# EasyEDA Pro project AC2024-欧标单相v1.2（使用立创EDA专业版）.epro, schematic _AC2024-02

## Sheets
1 01_AC
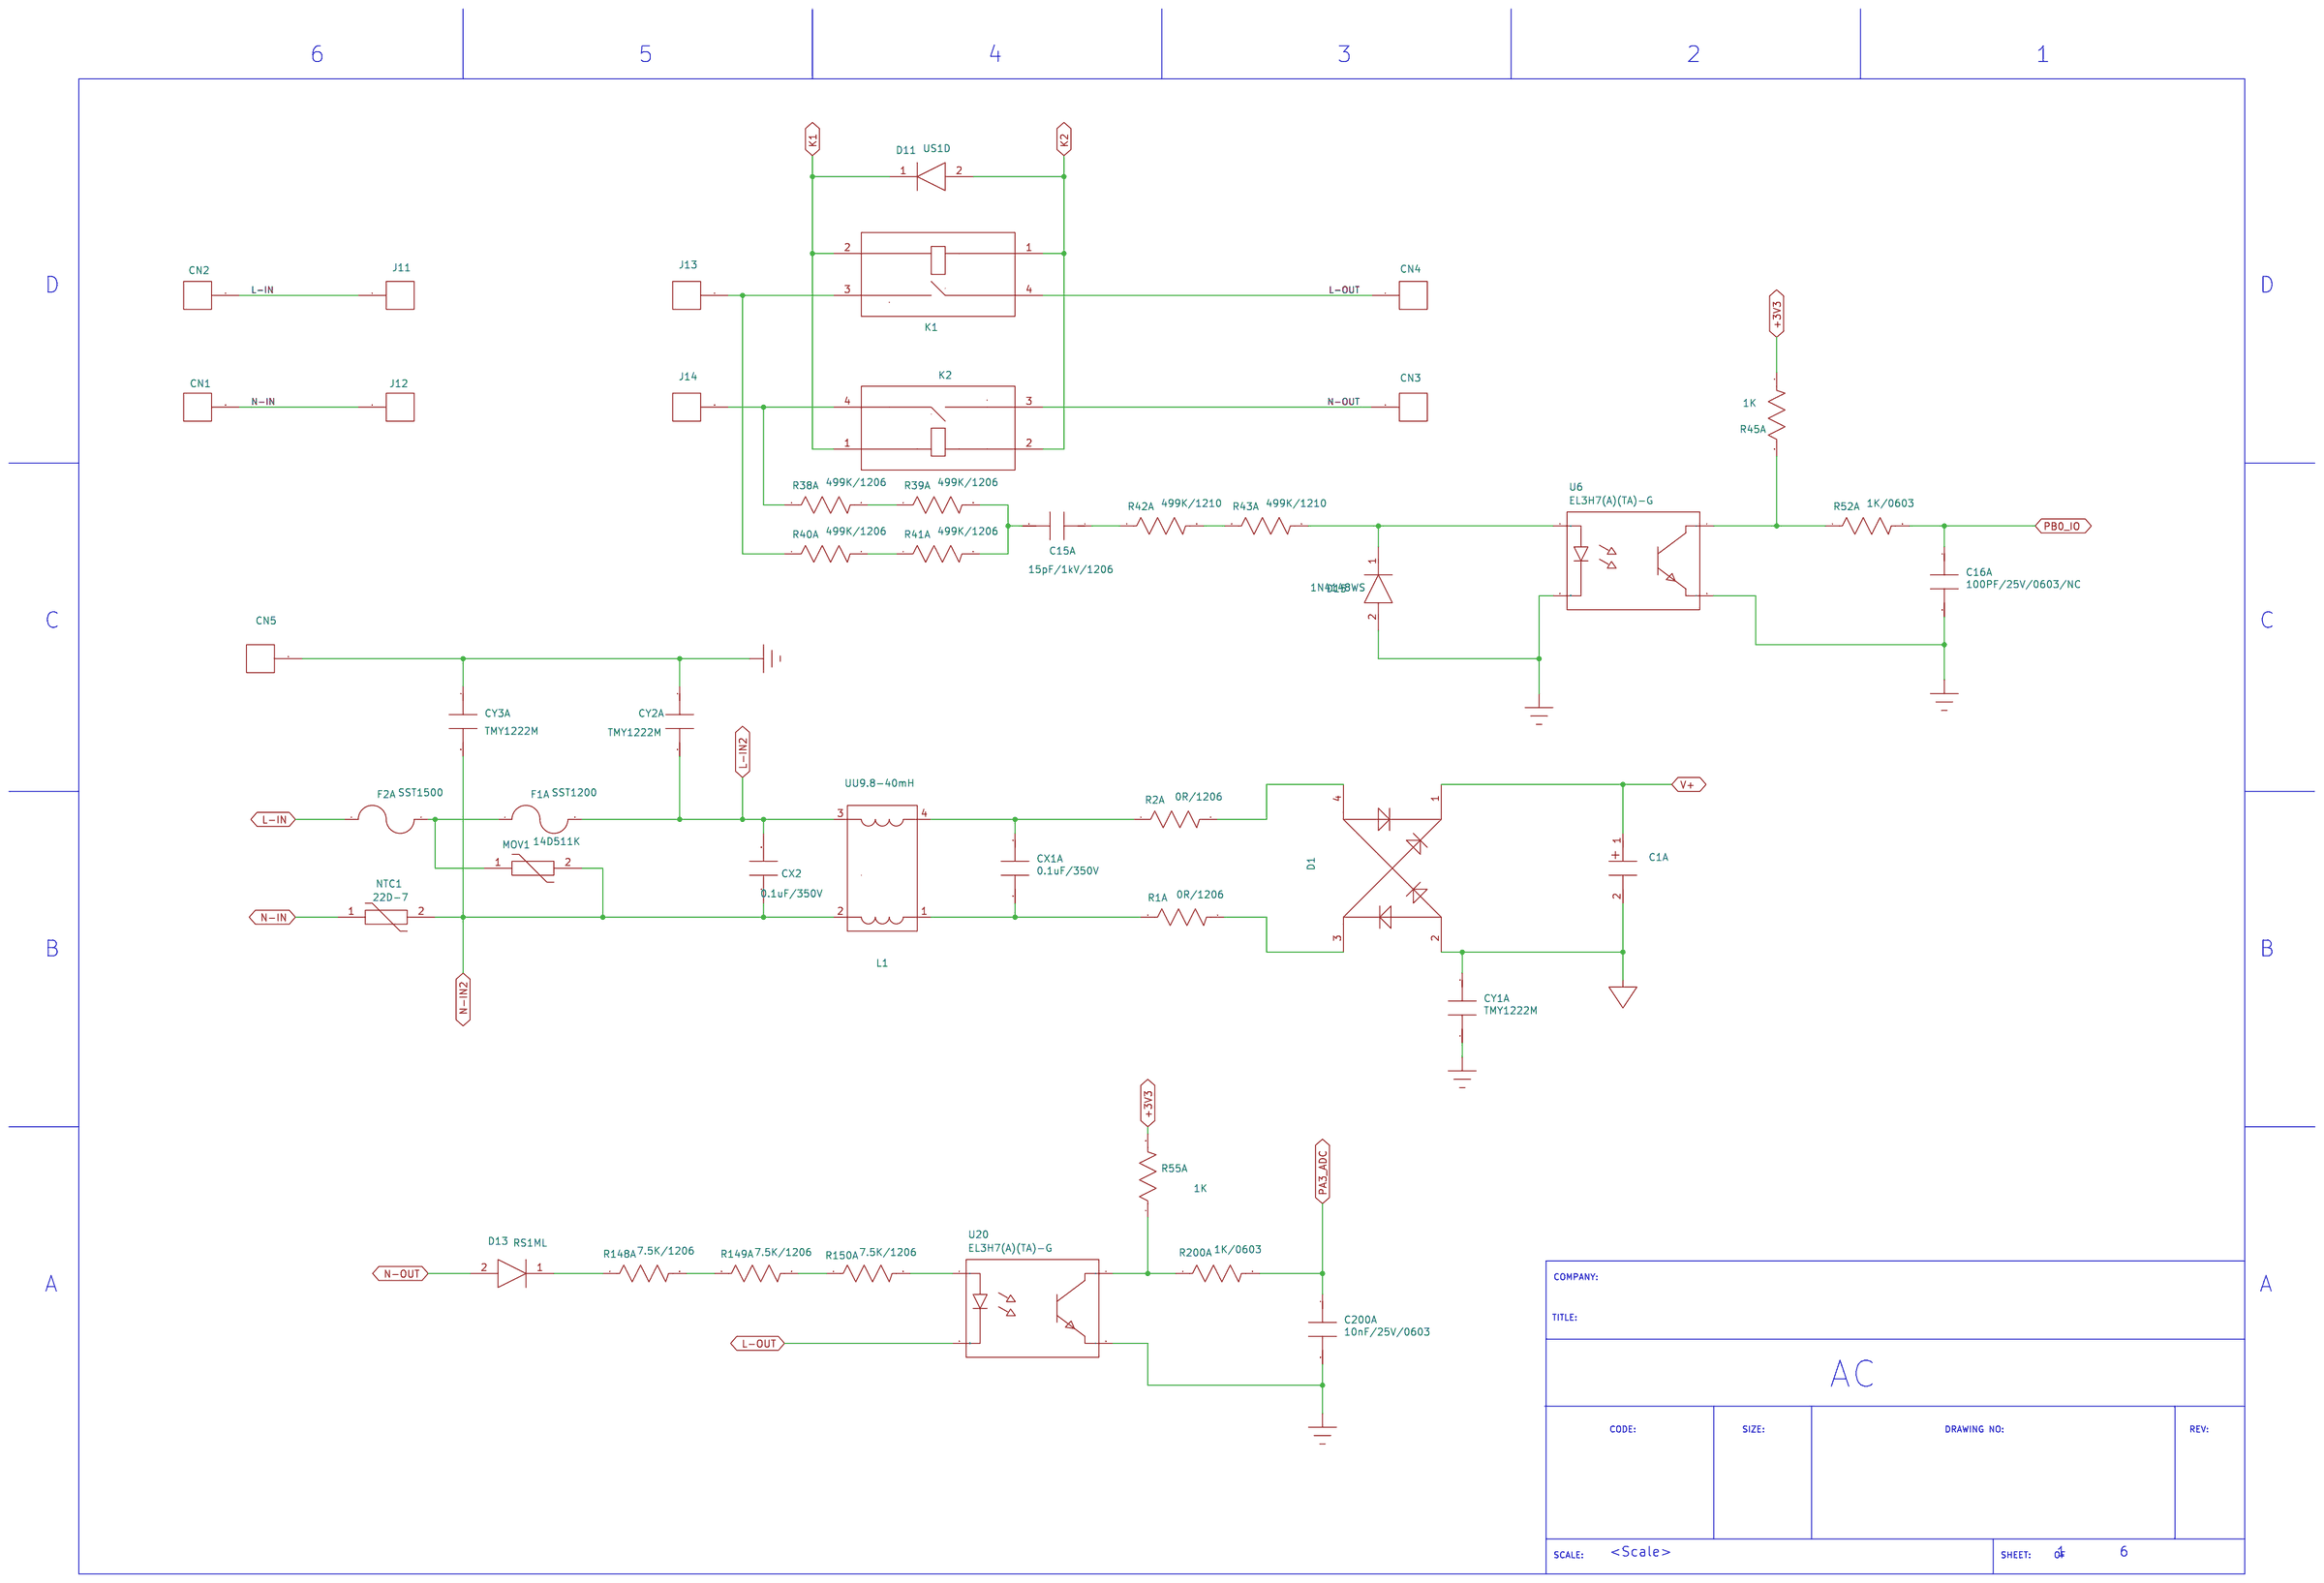
[diagram p0: 01_AC]
2 02_DC: Board Name: _AC2024-02; Create Date: 2025-07-22; Page Name: 02_DC; Project Name: AC2024-02欧标单相; Schematic Name: _AC2024-02; Update Date: 2025-11-24; Number of Sheets: 6; Scale: <Scale>; Sheet Number: 2
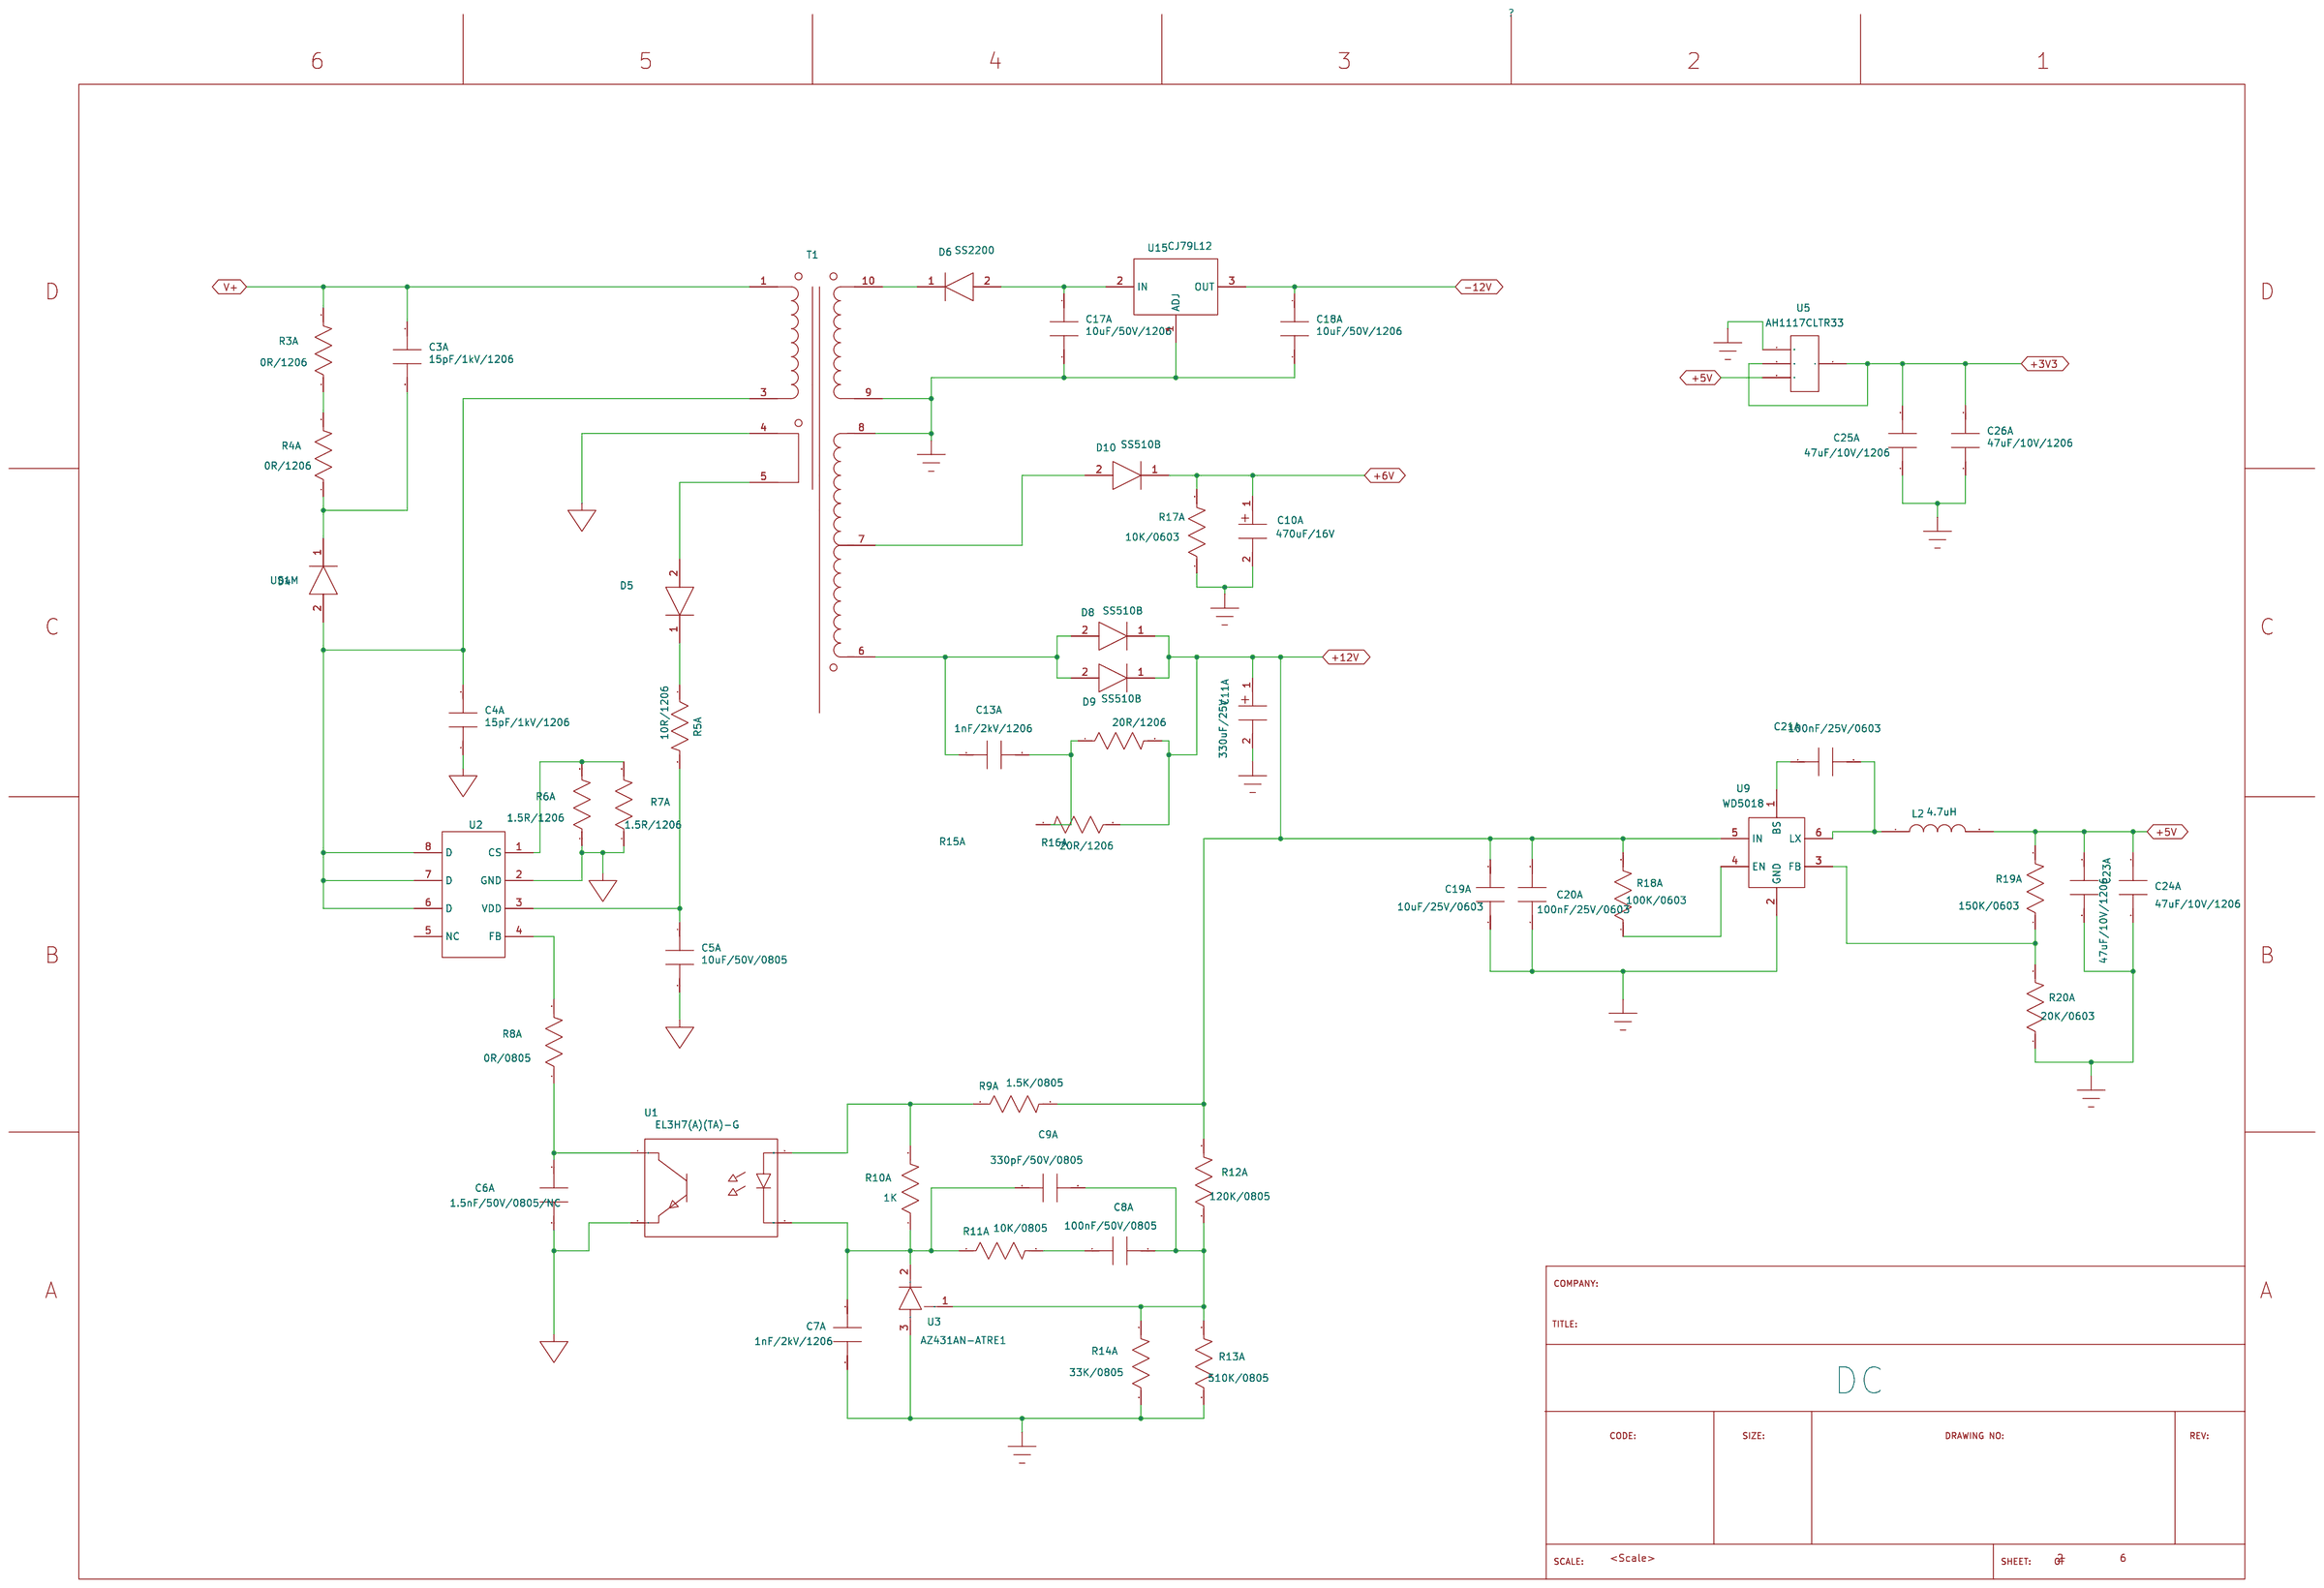
[diagram p1: 02_DC]
3 03_KZ: Board Name: _AC2024-02; Create Date: 2025-07-22; Page Name: 03_KZ; Project Name: AC2024-02欧标单相; Schematic Name: _AC2024-02; Update Date: 2025-07-22; Number of Sheets: 6; Scale: <Scale>; Sheet Number: 3
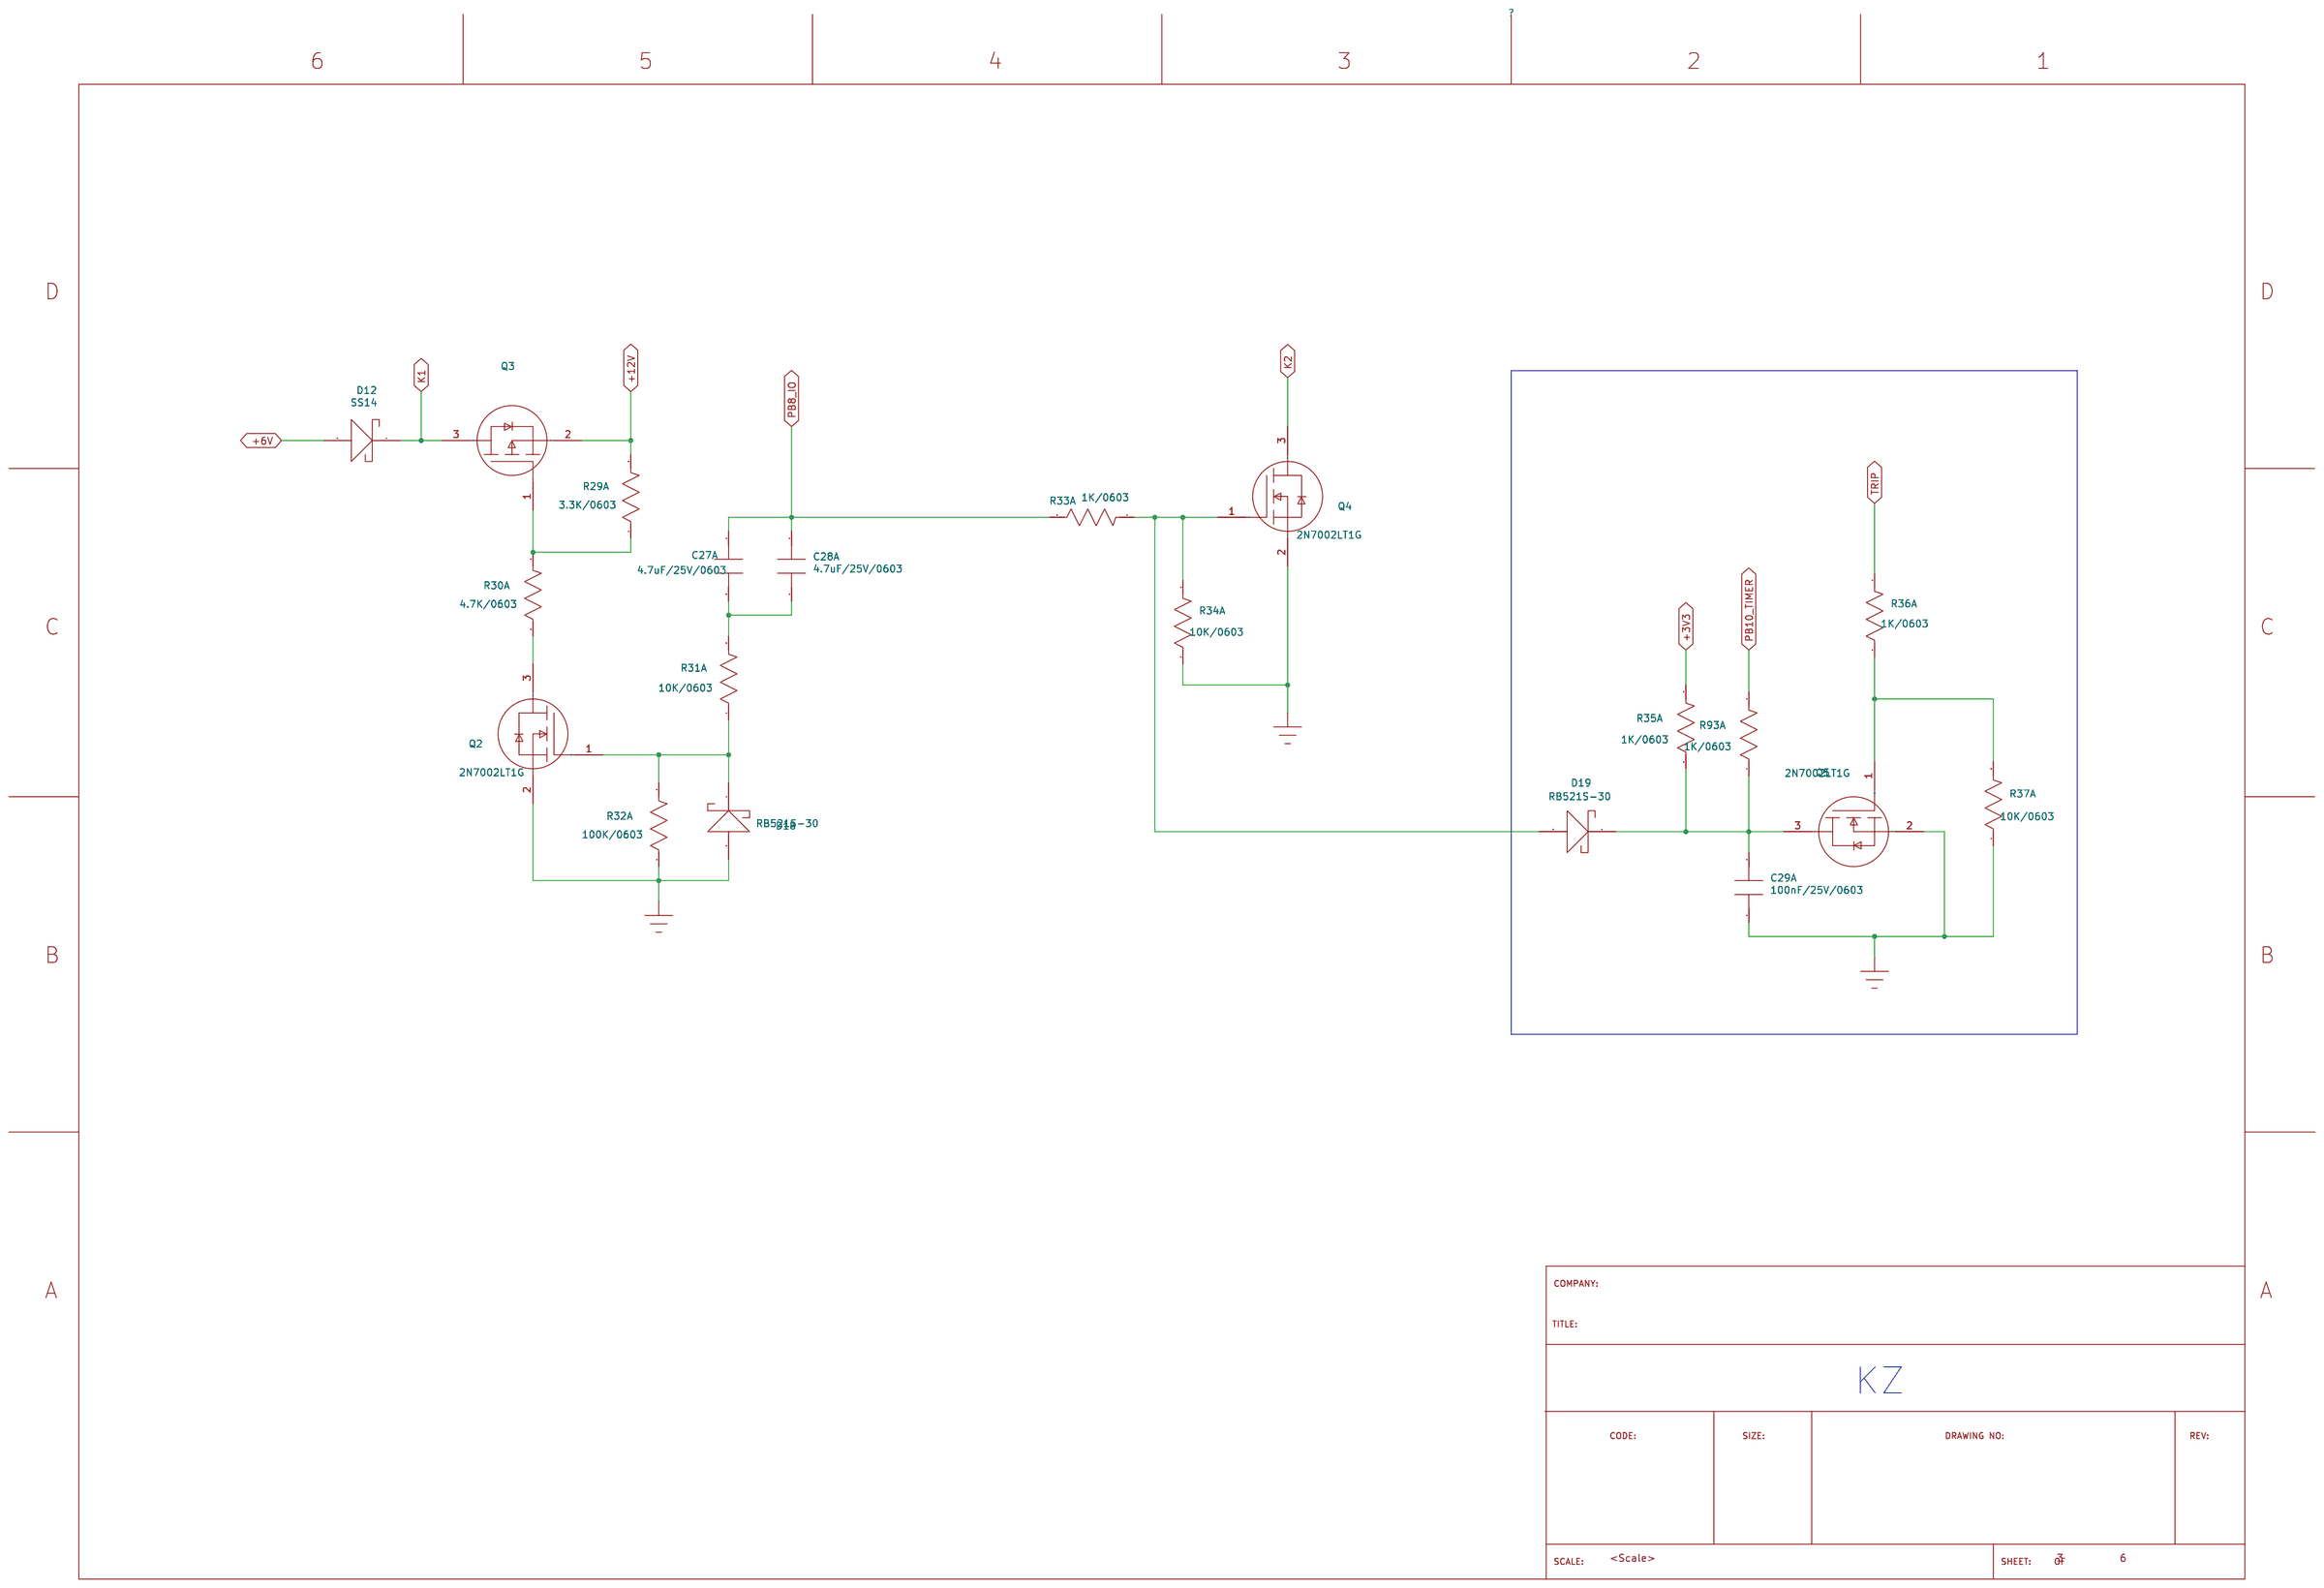
[diagram p2: 03_KZ]
4 04_CP
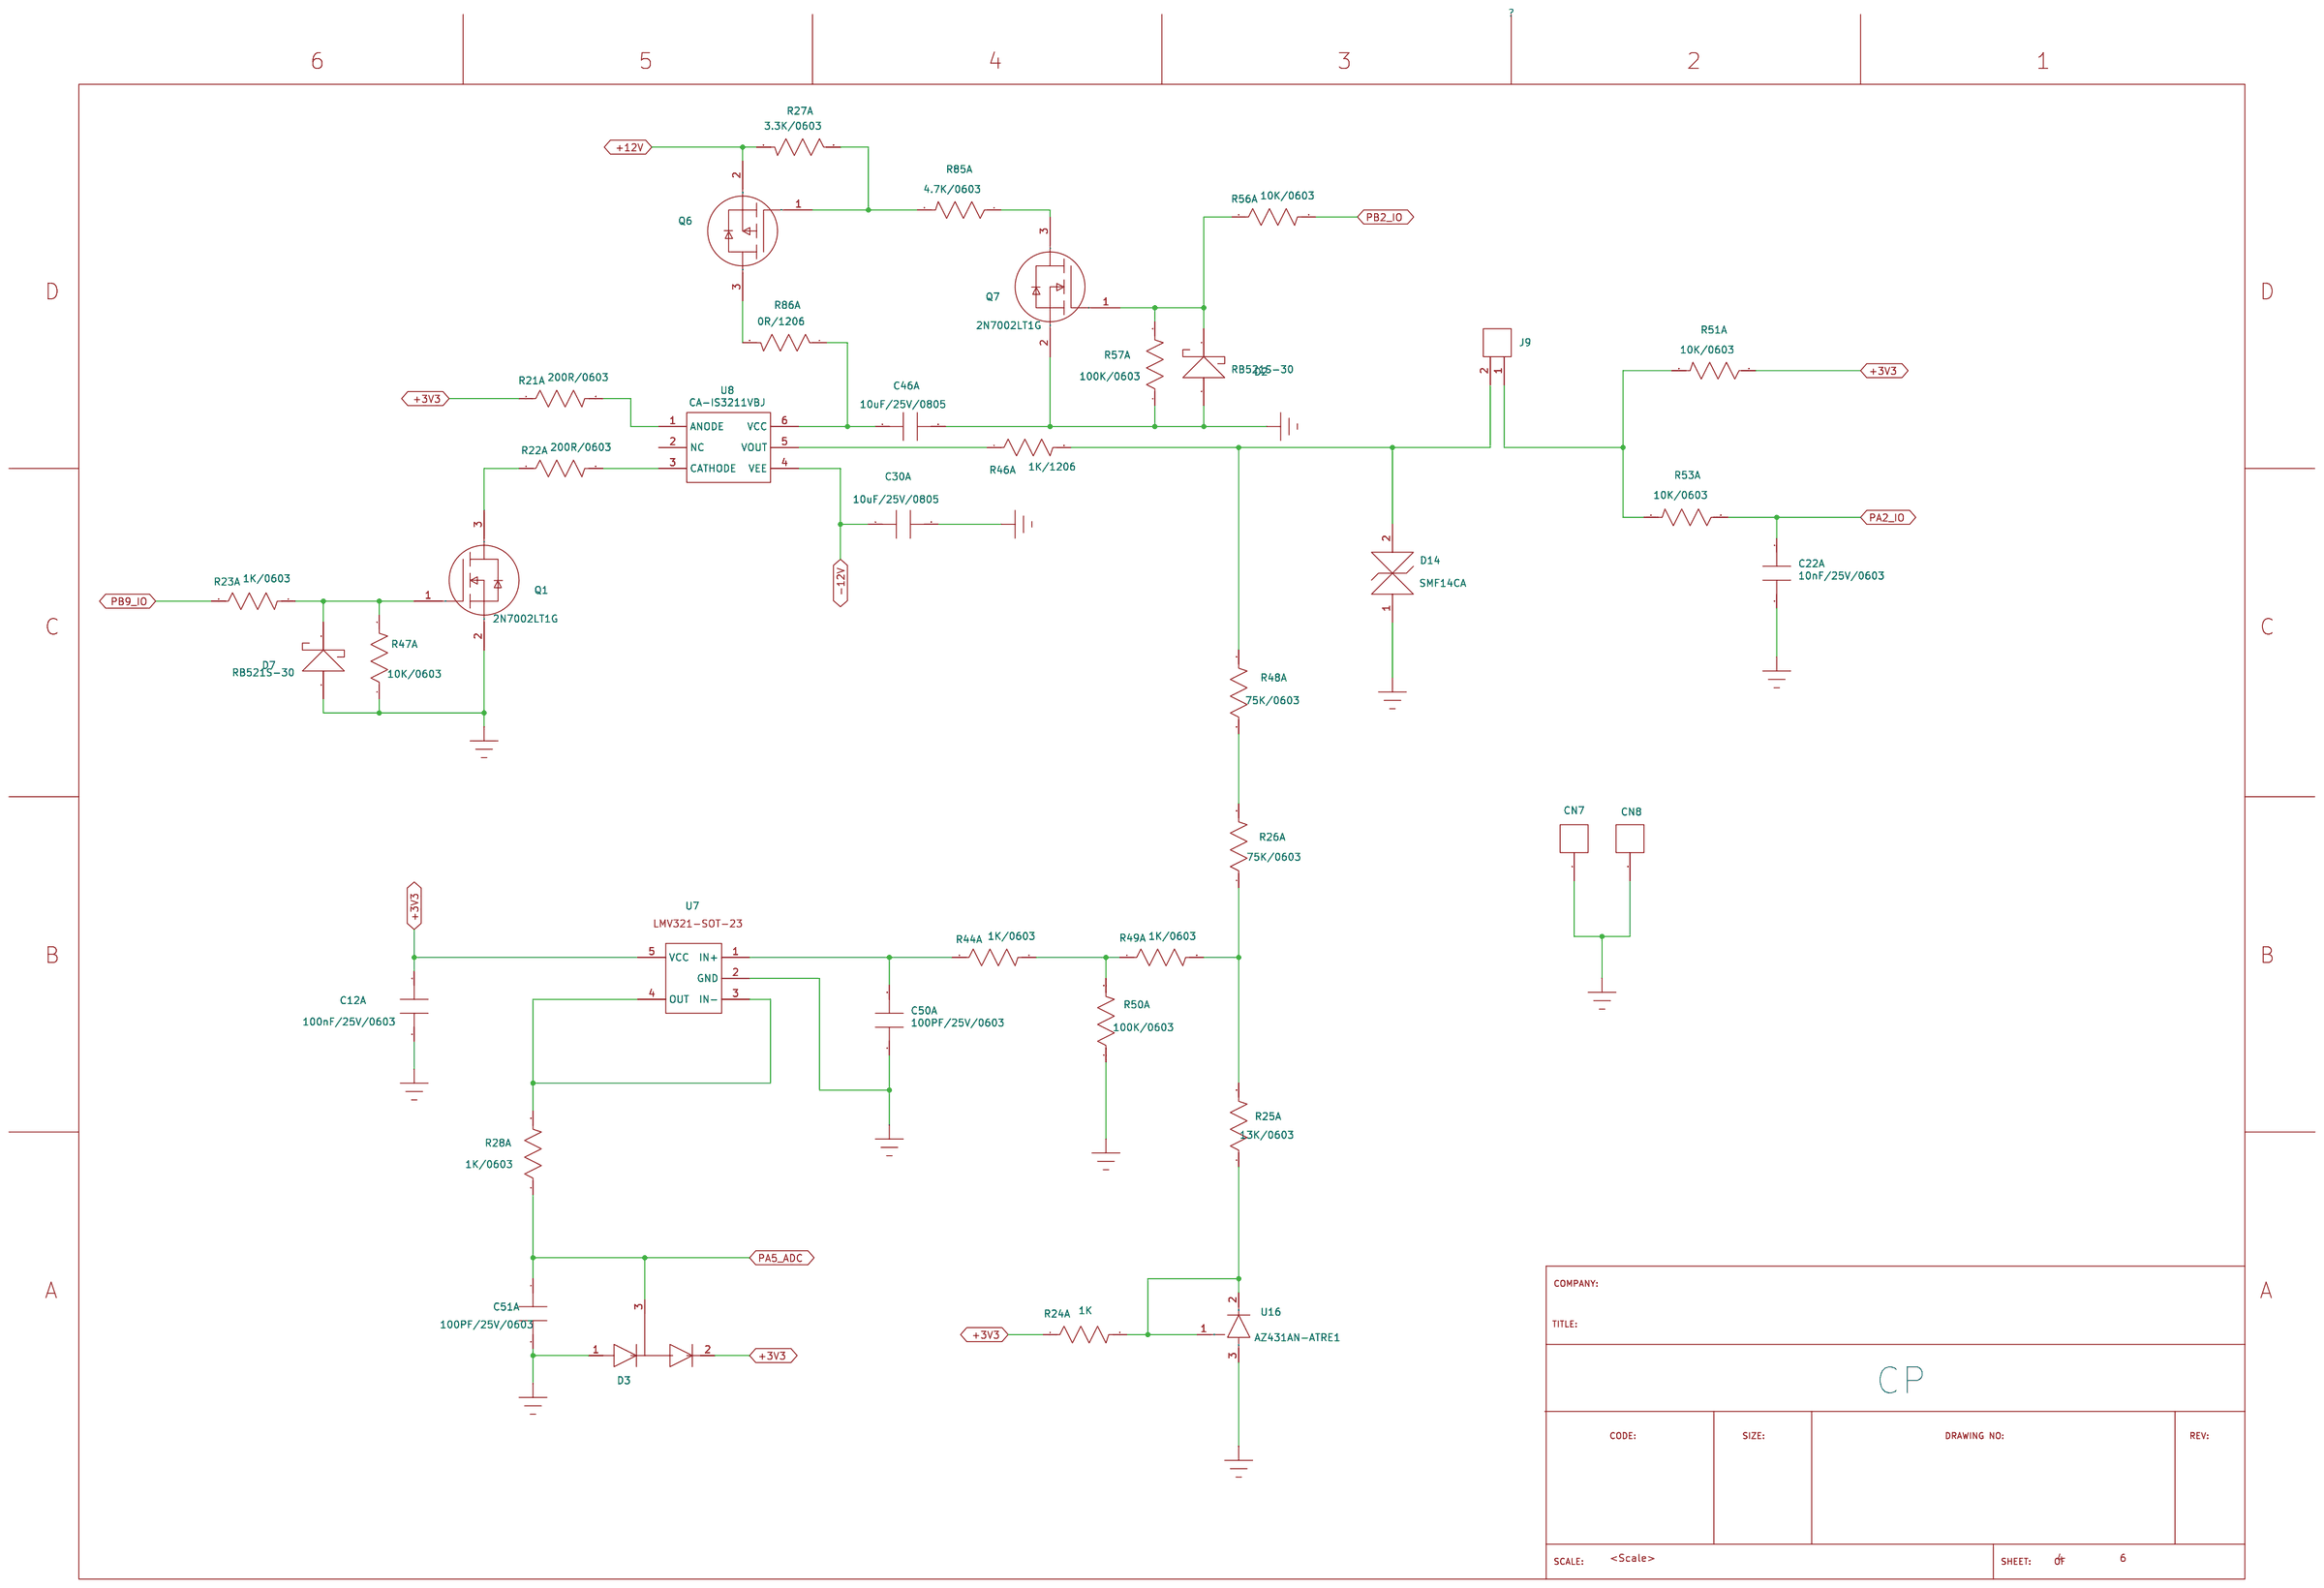
[diagram p3: 04_CP]
5 05_CY: Board Name: _AC2024-02; Create Date: 2025-07-22; Page Name: 05_CY; Project Name: AC2024-02欧标单相; Schematic Name: _AC2024-02; Update Date: 2025-07-22; Number of Sheets: 6; Scale: <Scale>; Sheet Number: 5
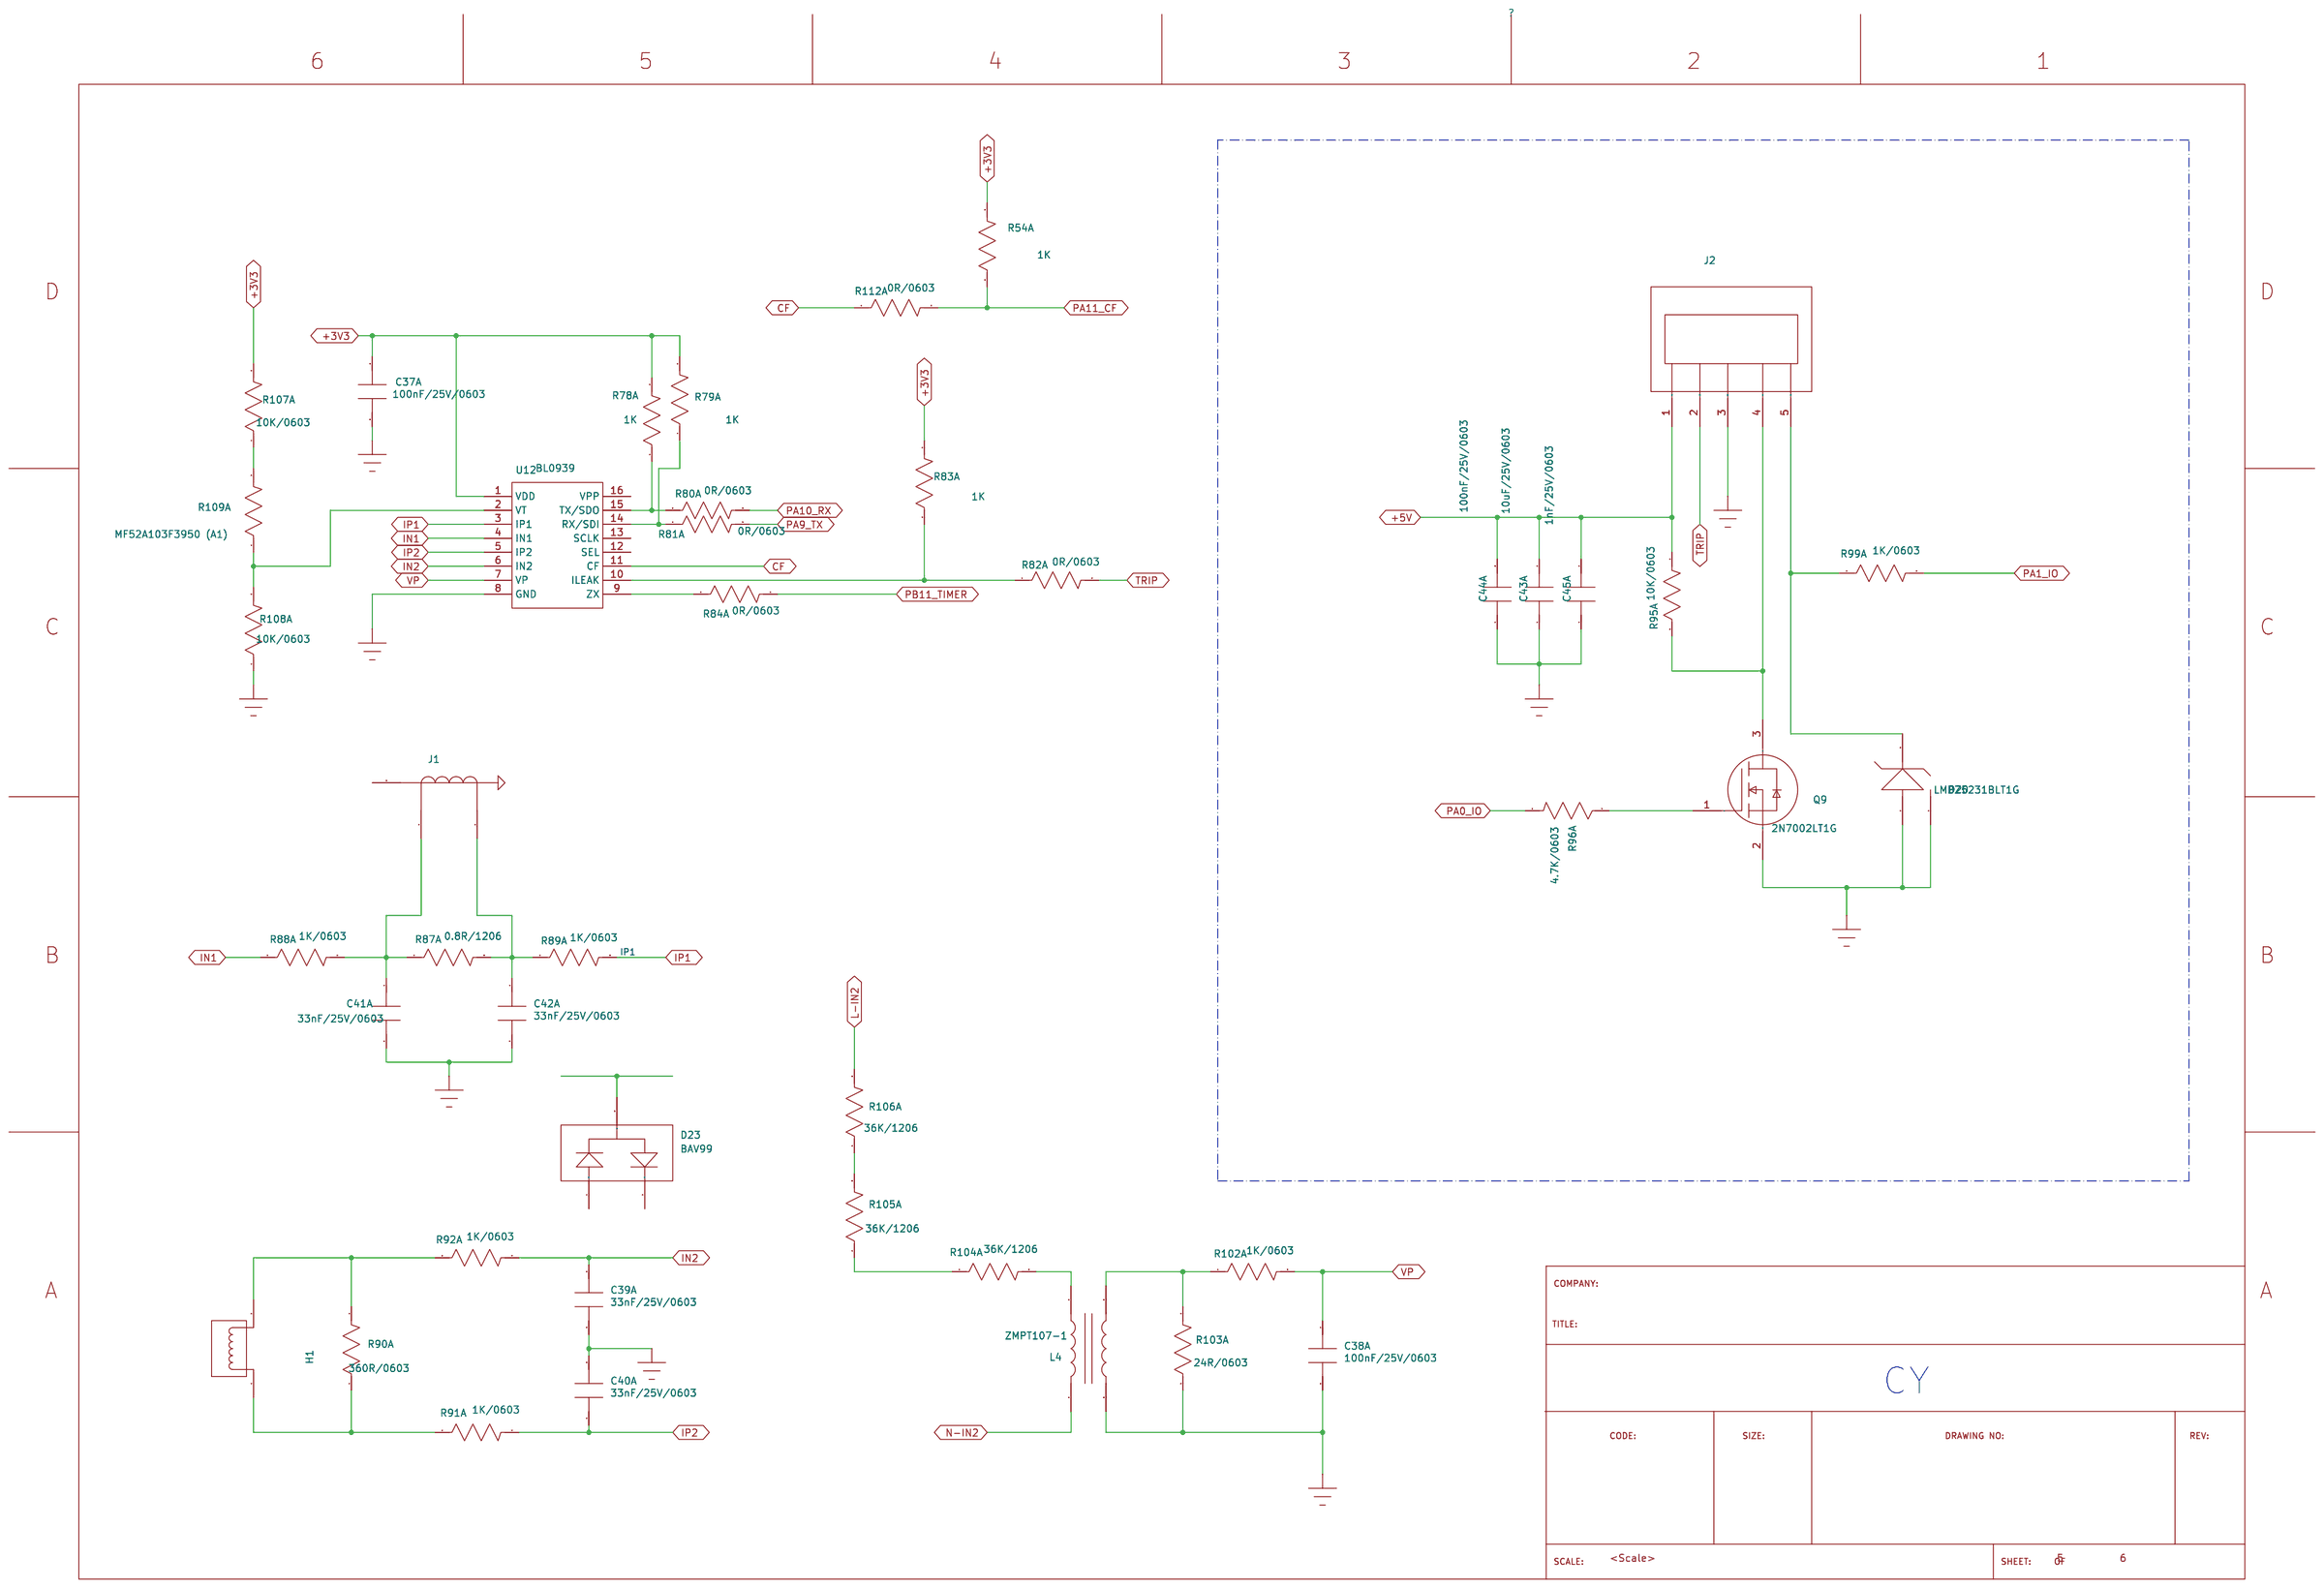
[diagram p4: 05_CY]
6 06_MCU
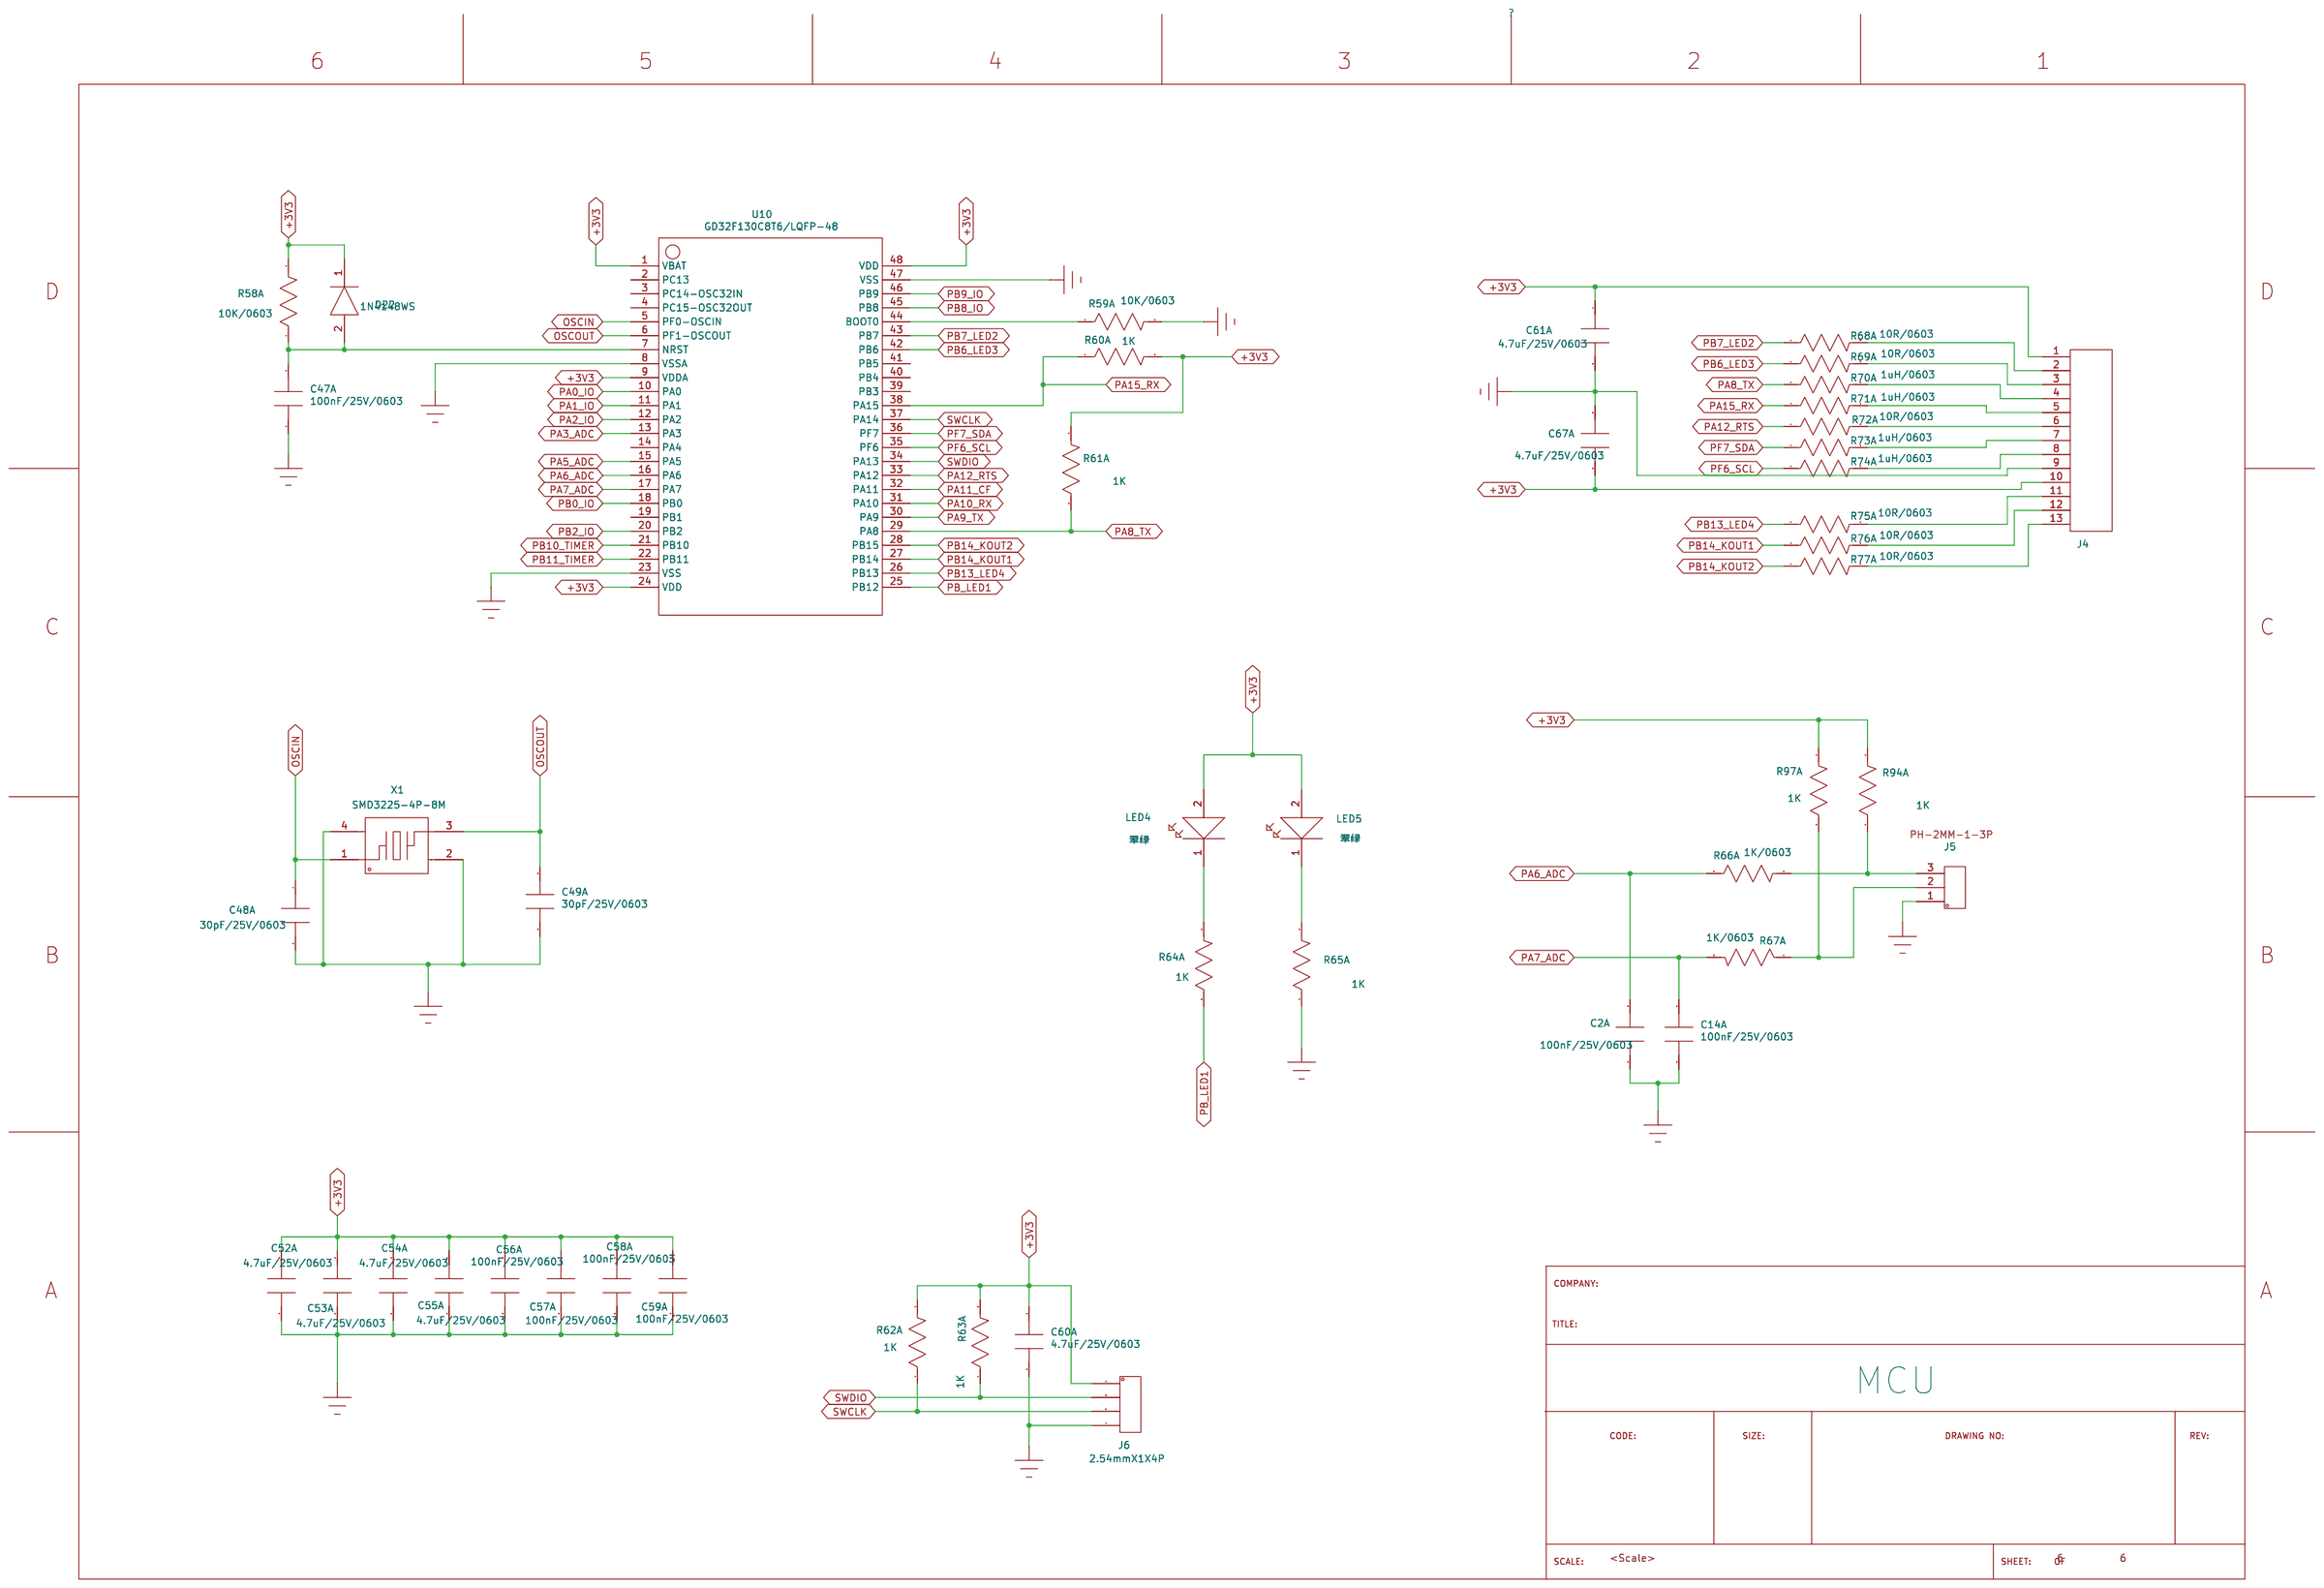
[diagram p5: 06_MCU]
7 P7: Create Date: 2025-10-23; Company: 嘉立创EDA; Page Size: A4; Version: V1.0
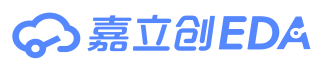
[diagram p6: P7]

## Parts
sheet 01_AC
C1  CAP-AE4  [C-P-5MM]  (section A_CAP+)
C15  15pF/1kV/1206  [C1206]  (section A_CAP)
C16  100PF/25V/0603/NC  [C0603]  (section A_CAP)
C200  10nF/25V/0603  [C0603]  (section A_CAP)
CN1  YZ-9/5mmX9.9mm  [YZ-9]
CN2  YZ-9/5mmX9.9mm  [YZ-9]
CN3  YZ-9/5mmX9.9mm  [YZ-9]
CN4  YZ-9/5mmX9.9mm  [YZ-9]
CN5  ZY-65/5X8  [YZ-63/5X8]
CX1  0.1uF/350V  [DIP-X2-7.5MM]  (section A_CAP)
CX2  0.1uF/350V  [DIP-X2-7.5MM]
CY1  TMY1222M  [SMD-Y1-5.4X7.8MM]  (section A_CAP)
CY2  TMY1222M  [SMD-Y1-5.4X7.8MM]  (section A_CAP)
CY3  TMY1222M  [SMD-Y1-5.4X7.8MM]  (section A_CAP)
D1  MB10S  [MB10S-MBS]
D11  US1D  [SMA-DO-214AC]
D13  RS1ML  [SOD-123FL-SMF14A]
D15  1N4148WS  [SOD-323]
F1  SST1200  [SMD-F-6.1X2.7MM]  (section A_FUSE-H)
F2  SST1500  [SMD-F-6.1X2.7MM]  (section A_FUSE-H)
J11  F10-10-6.5-0.4 Z  [3.1-3.8/5/6]
J12  F10-10-6.5-0.4 Z  [3.1-3.8/5/6]
J13  F10-10-6.5-0.4 Z  [3.2/4-6]
J14  F10-10-6.5-0.4 Z  [3.2/4-6]
K1  HF161  [HF161F-W/12-HT/2]
K2  HF161  [HF161F-W/12-HT/2]
L1  UU9.8-40mH  [UU9.8-40MH]
MOV1  14D511K  [DIP-RV-7.5MM]
NTC1  22D-7  [NTC-22D-7-P=5MM]
R1  0R/1206  [R1206]  (section A_RESZ-H)
R2  0R/1206  [R1206]  (section A_RESZ-H)
R38  499K/1206  [R1206]  (section A_RESZ-H)
R39  499K/1206  [R1206]  (section A_RESZ-H)
R40  499K/1206  [R1206]  (section A_RESZ-H)
R41  499K/1206  [R1206]  (section A_RESZ-H)
R42  499K/1210  [R1210]  (section A_RESZ-H)
R43  499K/1210  [R1210]  (section A_RESZ-H)
R45  1K  [R0603]  (section A_RESZ-H)
R52  1K/0603  [R0603]  (section A_RESZ-H)
R55  1K  [R0603]  (section A_RESZ-H)
R148  7.5K/1206  [R1206]  (section A_RESZ-H)
R149  7.5K/1206  [R1206]  (section A_RESZ-H)
R150  7.5K/1206  [R1206]  (section A_RESZ-H)
R200  1K/0603  [R0603]  (section A_RESZ-H)
U6  EL3H7(A)(TA)-G  [SSOP-4]
U20  EL3H7(A)(TA)-G  [SSOP-4]
sheet 02_DC
C3  15pF/1kV/1206  [C1206]  (section A_CAP)
C4  15pF/1kV/1206  [C1206]  (section A_CAP)
C5  10uF/50V/0805  [C0805]  (section A_CAP)
C6  1.5nF/50V/0805/NC  [C0805]  (section A_CAP)
C7  1nF/2kV/1206  [C1206]  (section A_CAP)
C8  100nF/50V/0805  [C0805]  (section A_CAP)
C9  330pF/50V/0805  [C0805]  (section A_CAP)
C10  470uF/16V  [SMD-C-D8XL10.5MM]  (section A_CAP+)
C11  330uF/25V  [SMD-C-D8XL10.5MM]  (section A_CAP+)
C13  1nF/2kV/1206  [C1206]  (section A_CAP)
C17  10uF/50V/1206  [C1206]  (section A_CAP)
C18  10uF/50V/1206  [C1206]  (section A_CAP)
C19  10uF/25V/0603  [C0603]  (section A_CAP)
C20  100nF/25V/0603  [C0603]  (section A_CAP)
C21  100nF/25V/0603  [C0603]  (section A_CAP)
C23  47uF/10V/1206  [C1206]  (section A_CAP)
C24  47uF/10V/1206  [C1206]  (section A_CAP)
C25  47uF/10V/1206  [C1206]  (section A_CAP)
C26  47uF/10V/1206  [C1206]  (section A_CAP)
D4  US1M  [SMA-DO-214AC]
D5  D  [SMAF]
D6  SS2200  [SMA-DO-214AC]
D8  SS510B  [SMB-DO-214AA]
D9  SS510B  [SMB-DO-214AA]
D10  SS510B  [SMB-DO-214AA]
L2  4.7uH  [SMD/L/5X5MM]
R3  0R/1206  [R1206]  (section A_RESZ-H)
R4  0R/1206  [R1206]  (section A_RESZ-H)
R5  10R/1206  [R1206]  (section A_RESZ-H)
R6  1.5R/1206  [R1206]  (section A_RESZ-H)
R7  1.5R/1206  [R1206]  (section A_RESZ-H)
R8  0R/0805  [R0805]  (section A_RESZ-H)
R9  1.5K/0805  [R0805]  (section A_RESZ-H)
R10  1K  [R0805]  (section A_RESZ-H)
R11  10K/0805  [R0805]  (section A_RESZ-H)
R12  120K/0805  [R0805]  (section A_RESZ-H)
R13  510K/0805  [R0805]  (section A_RESZ-H)
R14  33K/0805  [R0805]  (section A_RESZ-H)
R15  20R/1206  [R1206]  (section A_RESZ-H)
R16  20R/1206  [R1206]  (section A_RESZ-H)
R17  10K/0603  [R0603]  (section A_RESZ-H)
R18  100K/0603  [R0603]  (section A_RESZ-H)
R19  150K/0603  [R0603]  (section A_RESZ-H)
R20  20K/0603  [R0603]  (section A_RESZ-H)
T1  T-10  [EE16-4-5]
U1  EL3H7(A)(TA)-G  [SSOP-4]
U2  OB5102P  [DIP8-2]
U3  AZ431AN-ATRE1  [SOT-23]
U5  AH1117CLTR33  [SOT-223-3]
U9  WD5018  [SOT23-6]
U15  CJ79L12  [SOT-89]
sheet 03_KZ
C27  4.7uF/25V/0603  [C0603]  (section A_CAP)
C28  4.7uF/25V/0603  [C0603]  (section A_CAP)
C29  100nF/25V/0603  [C0603]  (section A_CAP)
D12  SS14  [SMA-DO-214AC]
D18  RB521S-30  [SOD-523]
D19  RB521S-30  [SOD-523]
Q2  2N7002LT1G  [SOT-23]
Q3  AO3407(P)  [SOT-23]
Q4  2N7002LT1G  [SOT-23]
Q5  2N7002LT1G  [SOT-23]
R29  3.3K/0603  [R0603]  (section A_RESZ-H)
R30  4.7K/0603  [R0603]  (section A_RESZ-H)
R31  10K/0603  [R0603]  (section A_RESZ-H)
R32  100K/0603  [R0603]  (section A_RESZ-H)
R33  1K/0603  [R0603]  (section A_RESZ-H)
R34  10K/0603  [R0603]  (section A_RESZ-H)
R35  1K/0603  [R0603]  (section A_RESZ-H)
R36  1K/0603  [R0603]  (section A_RESZ-H)
R37  10K/0603  [R0603]  (section A_RESZ-H)
R93  1K/0603  [R0603]  (section A_RESZ-H)
sheet 04_CP
C12  100nF/25V/0603  [C0603]  (section A_CAP)
C22  10nF/25V/0603  [C0603]  (section A_CAP)
C30  10uF/25V/0805  [C0805]  (section A_CAP)
C46  10uF/25V/0805  [C0805]  (section A_CAP)
C50  100PF/25V/0603  [C0603]  (section A_CAP)
C51  100PF/25V/0603  [C0603]  (section A_CAP)
CN7  CN  [4/5.5]
CN8  CN  [4/5.5]
D2  RB521S-30  [SOD-523]
D3  BAT54S  [SOT-23]
D7  RB521S-30  [SOD-523]
D14  SMF14CA  [SOD-123FL-SMF14A]
J9  KF142V  [KF142R]
Q1  2N7002LT1G  [SOT-23]
Q6  AO3407(P)  [SOT-23]
Q7  2N7002LT1G  [SOT-23]
R21  200R/0603  [R0603]  (section A_RESZ-H)
R22  200R/0603  [R0603]  (section A_RESZ-H)
R23  1K/0603  [R0603]  (section A_RESZ-H)
R24  1K  [R0603]  (section A_RESZ-H)
R25  13K/0603  [R0603]  (section A_RESZ-H)
R26  75K/0603  [R0603]  (section A_RESZ-H)
R27  3.3K/0603  [R0603]  (section A_RESZ-H)
R28  1K/0603  [R0603]  (section A_RESZ-H)
R44  1K/0603  [R0603]  (section A_RESZ-H)
R46  1K/1206  [R1206]  (section A_RESZ-H)
R47  10K/0603  [R0603]  (section A_RESZ-H)
R48  75K/0603  [R0603]  (section A_RESZ-H)
R49  1K/0603  [R0603]  (section A_RESZ-H)
R50  100K/0603  [R0603]  (section A_RESZ-H)
R51  10K/0603  [R0603]  (section A_RESZ-H)
R53  10K/0603  [R0603]  (section A_RESZ-H)
R56  10K/0603  [R0603]  (section A_RESZ-H)
R57  100K/0603  [R0603]  (section A_RESZ-H)
R85  4.7K/0603  [R0603]  (section A_RESZ-H)
R86  0R/1206  [R1206]  (section A_RESZ-H)
U7  LMV321IDBVR  [SOT-23-5]
U8  CA-IS3211VBJ  [SOIC-6]
U16  AZ431AN-ATRE1  [SOT-23]
sheet 05_CY
C37  100nF/25V/0603  [C0603]  (section A_CAP)
C38  100nF/25V/0603  [C0603]  (section A_CAP)
C39  33nF/25V/0603  [C0603]  (section A_CAP)
C40  33nF/25V/0603  [C0603]  (section A_CAP)
C41  33nF/25V/0603  [C0603]  (section A_CAP)
C42  33nF/25V/0603  [C0603]  (section A_CAP)
C43  10uF/25V/0603  [C0603]  (section A_CAP)
C44  100nF/25V/0603  [C0603]  (section A_CAP)
C45  1nF/25V/0603  [C0603]  (section A_CAP)
D20  LMBZ5231BLT1G  [SOT-23]
D23  BAV99  [SOT-23-3_L2.9-W1.3-P1.90-LS2.4-BR]  (no BOM)
H1  ZCT57-06N-02  [ZCT57-06N-02/2]
J1  ZCT105-01  [ZCT105-01]
J2  MC003E1-A1  [MC003E1-A1]
L4  ZMPT107-1  [ZMPT107-1]
Q9  2N7002LT1G  [SOT-23]
R54  1K  [R0603]  (section A_RESZ-H)
R78  1K  [R0603]  (section A_RESZ-H)
R79  1K  [R0603]  (section A_RESZ-H)
R80  0R/0603  [R0603]  (section A_RESZ-H)
R81  0R/0603  [R0603]  (section A_RESZ-H)
R82  0R/0603  [R0603]  (section A_RESZ-H)
R83  1K  [R0603]  (section A_RESZ-H)
R84  0R/0603  [R0603]  (section A_RESZ-H)
R87  0.8R/1206  [R1206]  (section A_RESZ-H)
R88  1K/0603  [R0603]  (section A_RESZ-H)
R89  1K/0603  [R0603]  (section A_RESZ-H)
R90  360R/0603  [R0603]  (section A_RESZ-H)
R91  1K/0603  [R0603]  (section A_RESZ-H)
R92  1K/0603  [R0603]  (section A_RESZ-H)
R95  10K/0603  [R0603]  (section A_RESZ-H)
R96  4.7K/0603  [R0603]  (section A_RESZ-H)
R99  1K/0603  [R0603]  (section A_RESZ-H)
R102  1K/0603  [R0603]  (section A_RESZ-H)
R103  24R/0603  [R0603]  (section A_RESZ-H)
R104  36K/1206  [R1206]  (section A_RESZ-H)
R105  36K/1206  [R1206]  (section A_RESZ-H)
R106  36K/1206  [R1206]  (section A_RESZ-H)
R107  10K/0603  [R0603]  (section A_RESZ-H)
R108  10K/0603  [R0603]  (section A_RESZ-H)
R109  MF52A103F3950 (A1)  [MF52A103F3950-NTC-2P]  (section A_RESZ-H)
R112  0R/0603  [R0603]  (section A_RESZ-H)
U12  BL0939  [SOP16L_BL0939]
sheet 06_MCU
C2  100nF/25V/0603  [C0603]  (section A_CAP)
C14  100nF/25V/0603  [C0603]  (section A_CAP)
C47  100nF/25V/0603  [C0603]  (section A_CAP)
C48  30pF/25V/0603  [C0603]  (section A_CAP)
C49  30pF/25V/0603  [C0603]  (section A_CAP)
C52  4.7uF/25V/0603  [C0603]  (section A_CAP)
C53  4.7uF/25V/0603  [C0603]  (section A_CAP)
C54  4.7uF/25V/0603  [C0603]  (section A_CAP)
C55  4.7uF/25V/0603  [C0603]  (section A_CAP)
C56  100nF/25V/0603  [C0603]  (section A_CAP)
C57  100nF/25V/0603  [C0603]  (section A_CAP)
C58  100nF/25V/0603  [C0603]  (section A_CAP)
C59  100nF/25V/0603  [C0603]  (section A_CAP)
C60  4.7uF/25V/0603  [C0603]  (section A_CAP)
C61  4.7uF/25V/0603  [C0603]  (section A_CAP)
C67  4.7uF/25V/0603  [C0603]  (section A_CAP)
D22  1N4148WS  [SOD-323]
J4  PH-1-2MM-13P  [1-2MM-13P]
J5  PH-1-2MM-3P  [DIP-1-2MM-3P]
J6  2.54mmX1X4P  [DIP-1-2.54MM-4P]
LED4  翠绿  [LED0805]
LED5  翠绿  [LED0805]
R58  10K/0603  [R0603]  (section A_RESZ-H)
R59  10K/0603  [R0603]  (section A_RESZ-H)
R60  1K  [R0603]  (section A_RESZ-H)
R61  1K  [R0603]  (section A_RESZ-H)
R62  1K  [R0603]  (section A_RESZ-H)
R63  1K  [R0603]  (section A_RESZ-H)
R64  1K  [R0603]  (section A_RESZ-H)
R65  1K  [R0603]  (section A_RESZ-H)
R66  1K/0603  [R0603]  (section A_RESZ-H)
R67  1K/0603  [R0603]  (section A_RESZ-H)
R68  10R/0603  [R0603]  (section A_RESZ-H)
R69  10R/0603  [R0603]  (section A_RESZ-H)
R70  1uH/0603  [R0603]  (section A_RESZ-H)
R71  1uH/0603  [R0603]  (section A_RESZ-H)
R72  10R/0603  [R0603]  (section A_RESZ-H)
R73  1uH/0603  [R0603]  (section A_RESZ-H)
R74  1uH/0603  [R0603]  (section A_RESZ-H)
R75  10R/0603  [R0603]  (section A_RESZ-H)
R76  10R/0603  [R0603]  (section A_RESZ-H)
R77  10R/0603  [R0603]  (section A_RESZ-H)
R94  1K  [R0603]  (section A_RESZ-H)
R97  1K  [R0603]  (section A_RESZ-H)
U10  GD32F130C8T6/LQFP-48  [LQFP-48]
X1  SMD3225-4P-8M  [SMD3225-4P]

## Library data of the parts
C1 = CAP-AE4: Manufacturer #1: SAMYOUNG(韩国三莹); Sim_Analog_Prefix: C; Sim_Analog_Order: Model$; Sim.Analog.Prefix: C; Sim.Analog.Order: Model$
C2-C5 C7-C9 C12-C15 C19-C30 C37-C61 C67 C200 = CAP0805: Manufacturer #1: IPC SM-782 STD.; Sim_Analog_Order: Value$; Sim_Analog_Prefix: c; Sim.Analog.Order: Value$; Sim.Analog.Prefix: c
C16 = CAP0805: 100PF/25V/0603; Manufacturer #1: IPC SM-782 STD.; Sim_Analog_Order: Value$; Sim_Analog_Prefix: c; Sim.Analog.Order: Value$; Sim.Analog.Prefix: c
CN1-CN4 = CN: YZ-9/9.2X11.1X12.6/5X9.9/1.2mm
CN5 = CN: ZY-65/尺寸9X6.5X17/脚距5mmX8/厚度1mm
CX1 = CAP0805: 0.1uF/350V/插件,P=7.5mm; Sim_Analog_Order: Value$; Sim_Analog_Prefix: c; Sim.Analog.Order: Value$; Sim.Analog.Prefix: c
CX2 = CAP-P2: 0.1uF/350V/插件,P=7.5mm
CY1-CY3 = CAP0805: 安规电容Y1/2200pF/400V/SMD-Y1-5.4X7.8MM; Manufacturer #1: TRX(特锐祥); Sim_Analog_Order: Value$; Sim_Analog_Prefix: c; Sim.Analog.Order: Value$; Sim.Analog.Prefix: c
D1 = MB10S: MB10S/MBS; Part Number: ？？？; Manufacturer #1: MDD(辰达半导体)
D11 = D: US1D/SMA; Manufacturer #1: MDD(辰达半导体)
D13 = D: RS1ML/SOD-123FL/长电
D15 = D: Manufacturer #1: CJ(江苏长电/长晶)
F1 = FUSE: 慢断保险丝/2A/300V/6.1X2.7mm; Manufacturer #1: Reomax(瑞迈); Sim_Analog_Order: Model$; Sim.Analog.Order: Model$
F2 = FUSE: 慢断保险丝/5A/300V/6.1X2.7mm; Manufacturer #1: Reomax(瑞迈); Sim_Analog_Order: Model$; Sim.Analog.Order: Model$
J11-J14 = CN: F10-10-6.5-0.4 Z/触摸弹簧; Manufacturer #1: Sam&wing(芯网)
K1 K2 = HF161: Sim_Analog_Order: Model$; Sim.Analog.Order: Model$
L1 = LH: Manufacturer #1: XR(祥如); Sim_Analog_Prefix: L; Sim_Analog_Order: Model$; Sim.Analog.Prefix: L; Sim.Analog.Order: Model$
MOV1 = NTC: 14D511K/DIP/压敏电阻
NTC1 = NTC: 22D-7 /插件,P=5mm
R1-R37 R44-R97 R99 R102-R108 R112 R148-R150 R200 = RES-1/4W: Sim_Analog_Prefix: R; Sim_Analog_Order: Model$; Sim.Analog.Prefix: R; Sim.Analog.Order: Model$
R38-R41 = RES-1/4W: 499K/1%/1206; Sim_Analog_Prefix: R; Sim_Analog_Order: Model$; Sim.Analog.Prefix: R; Sim.Analog.Order: Model$
R42 R43 = RES-1/4W: 499K/1%/1210; Sim_Analog_Prefix: R; Sim_Analog_Order: Model$; Sim.Analog.Prefix: R; Sim.Analog.Order: Model$
U1 U6 U20 = EL3H7(N): Manufacturer #1: EVERLIGHT(亿光); Part Number: ???
C6 = CAP0805: 1.5nF/50V/0805; Manufacturer #1: IPC SM-782 STD.; Sim_Analog_Order: Value$; Sim_Analog_Prefix: c; Sim.Analog.Order: Value$; Sim.Analog.Prefix: c
C10 = CAP-AE4: 470uF/16V/20%/SMD,D8xL10.5mm; Manufacturer #1: IPC SM-782 STD.; Sim_Analog_Prefix: C; Sim_Analog_Order: Model$; Sim.Analog.Prefix: C; Sim.Analog.Order: Model$
C11 = CAP-AE4: 330uF/25V/±20%/SMD,D8xL10.5mm; Manufacturer #1: IPC SM-782 STD.; Sim_Analog_Prefix: C; Sim_Analog_Order: Model$; Sim.Analog.Prefix: C; Sim.Analog.Order: Model$
C17 C18 = CAP0805: 10uF±10%/50V/1206/X5R; Manufacturer #1: IPC SM-782 STD.; Sim_Analog_Order: Value$; Sim_Analog_Prefix: c; Sim.Analog.Order: Value$; Sim.Analog.Prefix: c
D4 = D: US1M/SMA; Manufacturer #1: MDD(辰达半导体)
D5 = D
D6 = D: SS2200/SMA(DO-214AC); Manufacturer #1: MDD(辰达半导体)
D8-D10 = D: SS510B/SMB; Manufacturer #1: HXY MOSFET(华轩阳电子)
L2 = L1: YNR5040-4R7M/4.7uH/3A/30mΩ/SMD,5x5mm; Manufacturer #1: YJYCOIN(益嘉源)
T1 = T-10: EE16; Sim_Analog_Order: Model$; Sim.Analog.Order: Model$
U2 = OB5102P: OB5102P/DIP8; OB5102PAP-W_DIP8: 昂宝
U3 = AZ431(N): AZ431AN-ATRE1/SOT-23/2.5V; Manufacturer #1: DIODES; Part Number: BAS21LT1
U5 = H1117C: AH1117CLTR33/SOT-223-3; Manufacturer #1: BL(上海贝岭)
U9 = WD5018: WD5018/SOT23-6; Manufacturer #1: 深圳微电半导体
U15 = 79L12(N): CJ79L12/SOT-89-3/100mA; Manufacturer #1: CJ(江苏长电/长晶); Part Number: ???
D12 = SS14: SS14/SMA(DO-214AC); Manufacturer #1: MDD(辰达半导体)
D18 D19 = SS14: Manufacturer #1: TWGMC(台湾迪嘉)
Q1 Q2 Q4 Q5 Q7 = CJ2310(N): Part Number: ????; Manufacturer #1: 安森美
Q3 Q6 = AO3407(P): Part Number: ????
CN7 CN8 = CN
D2 D7 = SS14: RB521S-30/SOD-523; Manufacturer #1: TWGMC(台湾迪嘉)
D3 = BAT54S
D14 = D2: SMF14CA/ 双向/SOD-123FL; Manufacturer #1: CJ(江苏长电/长晶)
J9 = KF142R/V: KF142V/2P/P=5.08mm
U7 = LMV321-SOT-23: LMV321IDBVR/SOT-23-5; Manufacturer #1: TI(德州仪器)
U8 = CA-IS3211: CA-IS3211VBJ/SOIC-6-300mil; Manufacturer #1: Chipanalog(川土微)
U16 = AZ431(N): Manufacturer #1: DIODES; Part Number: BAS21LT1
D20 = LMBZ5231BLT1G: LMBZ5231BLT1G/SOT-23; Manufacturer #1: LRC(乐山无线电)
D23 = BAV99: 二极管配置:1对串联式;正向压降(Vf):1.25V@150mA;直流反向耐压(Vr):70V;整流电流:200mA;反向恢复时间(Trr):6ns;; Supplier Part: C2990827; Manufacturer: GOOD-ARK(固锝); Supplier Footprint: SOT-23; Datasheet: https://item.szlcsc.com/datasheet/BAV99/3451406.html; Supplier: LCSC; Diode Configuration: 1对串联式; Voltage - Forward(Vf@If): 1.25V@150mA; Voltage - DC Reverse(Vr): 70V; Current - Rectified: 200mA; Pd - Power Dissipation: 225mW; Reverse Leakage Current (Ir): 2.5uA@70V; Reverse Recovery Time (trr): 6ns; Operating Junction Temperature Range: -55℃~+150℃@(Tj); Non-Repetitive Peak Forward Surge Current: 500mA
H1 = ZCT57-06N-02: Manufacturer #1: 顺 水 电 子
J1 = CT1020: Manufacturer #1: 顺水
J2 = MC003E1-A1
L4 = ZMPT107: Manufacturer #1: 择明朗熙
Q9 = CJ2310(N): 2N7002LT1G/SOT-23; Part Number: ????; Manufacturer #1: 安森美
R109 = RES-1/4W: MF52A103F3950 (A1)/10K/NTC/DIP; Manufacturer #1: 时恒; Sim_Analog_Prefix: R; Sim_Analog_Order: Model$; Sim.Analog.Prefix: R; Sim.Analog.Order: Model$
U12 = BL0939: BL0939/SOP16L; Manufacturer #1: 贝岭
D22 = D: 1N4148WS/SOD-323; Manufacturer #1: CJ(江苏长电/长晶)
J4 = PH-2MM-1-13P: Manufacturer #1: 博驰
J5 = PH-2MM-1-3P: Manufacturer #1: 博驰
J6 = P2.45-1-4P
LED4 LED5 = LED1: 翠绿/0805
U10 = GD32F130C8T6: Manufacturer #1: GD
X1 = X3225_8M: X32258MOB4SI_4P/8M

## Nets
+3V3: C12.2 C25.1 C26.1 C37.1 C52.1 C53.1 C54.1 C55.1 C56.1 C57.1 C58.1 C59.1 C60.1 C61.1 C67.2 D3.2 D22.1 J4.1 J4.10 J6.1 LED4.2 LED5.2 R21.1 R24.1 R35.2 R45.2 R51.1 R54.2 R55.2 R58.2 R60.2 R61.2 R62.2 R63.2 R78.2 R79.2 R83.2 R94.2 R97.2 R107.2 U5.2(VOUT) U5.4(VOUT) U7.5(VCC) U10.1(VBAT) U10.9(VDDA) U10.24(VDD) U10.48(VDD) U12.1(VDD)
+5V: C23.1 C24.1 C43.2 C44.2 C45.2 J2.1(VDD) L2.2 R19.2 R95.2 U5.3(VIN)
+6V: C10.1 D10.1 D12.2 R17.2
+12V: C11.1 C19.1 C20.1 D8.1 D9.1 Q3.2(S) Q6.2(S) R9.2 R12.2 R15.2 R16.1 R18.2 R27.2 R29.2 U9.5(IN)
-12V: C18.1 C30.1 U8.4(VEE) U15.3(OUT)
AGND: C1.2 C4.2 C5.2 C6.2 CY1.1 D1.2 R6.1 R7.1 T1.4 U1.3(E) U2.2(GND)
GND: C2.2 C7.2 C10.2 C11.2 C12.1 C14.2 C16.2 C17.2 C18.2 C19.2 C20.2 C22.2 C23.2 C24.2 C25.2 C26.2 C29.2 C30.2 C37.2 C38.2 C39.2 C40.1 C41.2 C42.2 C43.1 C44.1 C45.1 C46.2 C47.2 C48.2 C49.2 C50.2 C51.2 C52.2 C53.2 C54.2 C55.2 C56.2 C57.2 C58.2 C59.2 C60.2 C61.2 C67.1 C200.2 CN5.1 CN7.1 CN8.1 CY1.2 CY2.1 CY3.1 D2.2 D3.1 D7.2 D14.1 D15.2 D18.2 D20.1 D20.2 J2.3(GND) J4.9 J5.1 J6.4 L4.2 Q1.2(S) Q2.2(S) Q4.2(S) Q5.2(S) Q7.2(S) Q9.2(S) R13.1 R14.1 R17.1 R20.1 R32.1 R34.1 R37.1 R47.1 R50.1 R57.1 R59.2 R65.1 R103.1 R108.1 T1.8 T1.9 U3.3(A) U5.1(VSS) U6.2(CATHODE) U6.3(E) U7.2(GND) U9.2(GND) U10.8(VSSA) U10.23(VSS) U10.47(VSS) U12.8(GND) U15.1(ADJ) U16.3(A) U20.3(E) X1.2(GND) X1.4(GND)
$$$1112: J2.4(CAL) Q9.3(D) R95.1
$$$1143: Q9.1(G) R96.1
$$$1163: D20.3 J2.5(TEST) R99.1
$$$1347: L4.3 R104.2
$$$1364: C13.2 R15.1 R16.2
$$$1652: D5.1 R5.1
$$$2054: R44.2 R49.1 R50.2
$$$5633: C42.1 J1.2 R87.2 R89.1
$$$6271: D10.2 T1.7
$$$7035: C50.1 R44.1 U7.1(IN+)
$$$7317: R8.2 U2.4(FB)
$$$7399: R21.2 U8.1(ANODE)
$$$7401: R22.2 U8.3(CATHODE)
$$$7548: R78.1 R80.1 U12.15(TX/SDO)
$$$7549: R79.1 R81.1 U12.14(RX/SDI)
$$$7993: R84.1 U12.9(ZX)
$$$8346: D15.1 R43.2 U6.1(ANODE)
$$$8373: R45.1 R52.1 U6.4(C)
$$$8545: D19.2 Q4.1(G) R33.2 R34.2
$$$8726: R25.2 R26.1 R49.2
$$$9148: R46.1 U8.5(VOUT)
$$$9261: C17.1 D6.2 U15.2(IN)
$$$9324: Q1.3(D) R22.1
$$$9328: D7.1 Q1.1(G) R23.2 R47.2
$$$10461: D14.2 J9.2 R46.2 R48.2
$$$12073: J4.2 R68.2
$$$12092: J4.3 R69.2
$$$12104: J4.4 R70.2
$$$12114: J4.5 R71.2
$$$12120: J4.6 R72.2
$$$12123: J4.7 R73.2
$$$12130: J4.8 R74.2
$$$12200: J4.11 R75.2
$$$12208: J4.12 R76.2
$$$12226: J4.13 R77.2
$$$12319: L4.1 R102.1 R103.2
$$$12325: R28.2 U7.3(IN-) U7.4(OUT)
$$$12363: C29.1 D19.1 Q5.3(D) R35.1 R93.1
$$$12722: R104.1 R105.1
$$$12725: R105.2 R106.1
$$$13023: C5.1 R5.2 U2.3(VDD)
$$$13434: C41.1 J1.1 R87.1 R88.2
$$$16336: R24.2 R25.1 U16.1(REF) U16.2(K)
$$$16471: CX1.2 L1.1 R1.1
$$$16480: CX1.1 L1.4 R2.1
$$$16618: Q6.1(G) R27.1 R85.2
$$$17793: J13.1 K1.3 R40.1
$$$17797: J14.1 K2.4 R38.1
$$$18525: LED5.1 R65.2
$$$18527: LED4.1 R64.2
$$$19309: D2.1 Q7.1(G) R56.1 R57.2
$$$19372: D1.4 R2.2
$$$19375: D1.3 R1.2
$$$20020: C46.1 R86.1 U8.6(VCC)
$$$20272: R82.1 R83.1 U12.10(ILEAK)
$$$20459: Q7.3(D) R85.1
$$$21949: F1.1 F2.2 MOV1.1
$$$22081: D5.2 T1.5
$$$22503: D6.1 T1.10
$$$22728: R6.2 R7.2 U2.1(CS)
$$$22952: C6.1 R8.1 U1.4(C)
$$$22982: J5.2 R67.1 R97.1
$$$23262: R107.1 R109.2
$$$23265: R108.2 R109.1 U12.2(VT)
$$$23653: Q6.3(D) R86.2
$$$24219: C13.1 D8.2 D9.2 T1.6
$$$24414: R26.2 R48.1
$$$25465: C4.1 D4.2 T1.3 U2.6(D) U2.7(D) U2.8(D)
$$$25516: R3.1 R4.2
$$$25519: C3.2 D4.1 R4.1
$$$26759: R38.2 R39.1
$$$26761: R40.2 R41.1
$$$26771: C15.2 R39.2 R41.2
$$$26783: C15.1 R42.1
$$$26785: R42.2 R43.1
$$$27745: Q3.1(G) R29.1 R30.2
$$$27755: Q2.3(D) R30.1
$$$27766: D18.1 Q2.1(G) R31.1 R32.2
$$$28006: Q5.1(G) R36.1 R37.2
$$$28651: C27.2 C28.2 R31.2
$$$28729: J9.1 R51.2 R53.2
$$$29092: R18.1 U9.4(EN)
$$$29133: C21.2 L2.1 U9.6(LX)
$$$29142: R19.1 R20.2 U9.3(FB)
$$$29315: C21.1 U9.1(BS)
$$$30967: R59.1 U10.44(BOOT0)
$$$31753: D13.1 R148.1
$$$31756: R148.2 R149.1
$$$31760: R149.2 R150.1
$$$31764: R150.2 U20.1(ANODE)
$$$31898: H1.1 R90.1 R91.1
$$$31899: H1.2 R90.2 R92.1
$$$31920: R55.1 R200.1 U20.4(C)
$$$32273: J5.3 R66.2 R94.1
$$$32678: R9.1 R10.2 U1.1(ANODE)
$$$32682: C7.1 C9.1 R10.1 R11.1 U1.2(CATHODE) U3.2(K)
$$$32728: C8.2 C9.2 R12.1 R13.2 R14.2 U3.1(REF)
$$$32733: C8.1 R11.2
CF: R112.1 U12.11(CF)
IN1: R88.1 U12.4(IN1)
IN2: C39.1 R92.2 U12.6(IN2)
IP1: R89.2 U12.3(IP1)
IP2: C40.2 R91.2 U12.5(IP2)
K1: D11.1 D12.1 K1.2 K2.1 Q3.3(D)
K2: D11.2 K1.1 K2.2 Q4.3(D)
L-IN: CN2.1 F2.1 J11.1
L-IN2: CX2.2 CY2.2 F1.2 L1.3 R106.2
L-OUT: CN4.1 K1.4 U20.2(CATHODE)
N-IN: CN1.1 J12.1 NTC1.1
N-IN2: CX2.1 CY3.2 L1.2 L4.4 MOV1.2 NTC1.2
N-OUT: CN3.1 D13.2 K2.3
NRST: C47.1 D22.2 R58.1 U10.7(NRST)
OSCIN: C48.1 U10.5(PF0-OSCIN) X1.1
OSCOUT: C49.1 U10.6(PF1-OSCOUT) X1.3
PA0_IO: R96.2 U10.10(PA0)
PA1_IO: R99.2 U10.11(PA1)
PA2_IO: C22.1 R53.1 U10.12(PA2)
PA3_ADC: C200.1 R200.2 U10.13(PA3)
PA5_ADC: C51.1 D3.3 R28.1 U10.15(PA5)
PA6_ADC: C2.1 R66.1 U10.16(PA6)
PA7_ADC: C14.1 R67.2 U10.17(PA7)
PA8_TX: R61.1 R70.1 U10.29(PA8)
PA9_TX: R81.2 U10.30(PA9)
PA10_RX: R80.2 U10.31(PA10)
PA11_CF: R54.1 R112.2 U10.32(PA11)
PA12_RTS: R72.1 U10.33(PA12)
PA15_RX: R60.1 R71.1 U10.38(PA15)
PB0_IO: C16.1 R52.2 U10.18(PB0)
PB2_IO: R56.2 U10.20(PB2)
PB6_LED3: R69.1 U10.42(PB6)
PB7_LED2: R68.1 U10.43(PB7)
PB8_IO: C27.1 C28.1 R33.1 U10.45(PB8)
PB9_IO: R23.1 U10.46(PB9)
PB10_TIMER: R93.2 U10.21(PB10)
PB11_TIMER: R84.2 U10.22(PB11)
PB13_LED4: R75.1 U10.26(PB13)
PB14_KOUT1: R76.1 U10.27(PB14)
PB14_KOUT2: R77.1 U10.28(PB15)
PB_LED1: R64.1 U10.25(PB12)
PF6_SCL: R74.1 U10.35(PF6)
PF7_SDA: R73.1 U10.36(PF7)
SWCLK: J6.3 R62.1 U10.37(PA14)
SWDIO: J6.2 R63.1 U10.34(PA13)
TRIP: J2.2(TRIP) R36.2 R82.2
V+: C1.1 C3.1 D1.1 R3.2 T1.1
VP: C38.1 R102.2 U12.7(VP)

Not connected (* = marked no-connect by the designer): D23 1 2 3; J1 3; U2 5(NC); U8 2(NC); U10 2(PC13) 3(PC14-OSC32IN) 4(PC15-OSC32OUT) 14(PA4) 19(PB1) 39(PB3) 40(PB4) 41(PB5); U12 12(SEL) 13(SCLK) 16(VPP)

## Notes on the sheets
sheet 1
- 6
- 5
- 4
- 3
- 2
- 1
- D
- D
- C
- C
- B
- B
- COMPANY:
- A
- A
- TITLE:
- AC
- CODE:
- SIZE:
- DRAWING NO:
- REV:
- SCALE:
- <Scale>
- SHEET:     OF
- 1
- 6
sheet 2
- DC
sheet 3
- KZ
sheet 4
- CP
sheet 5
- CY
sheet 6
- MCU
